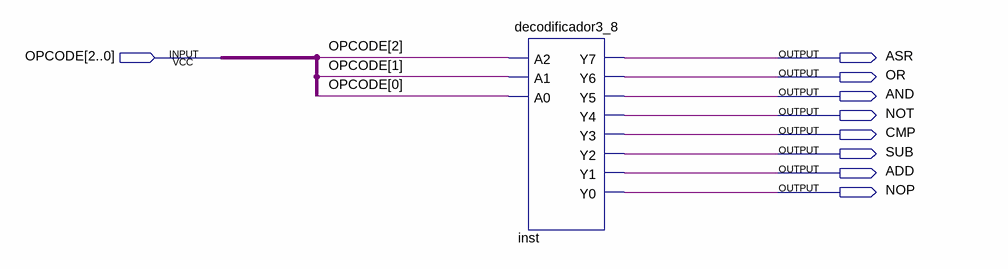
[diagram p0: schematic sheet]
// Quartus schematic inst_decoder.bdf as structural Verilog: 1 symbols, 9 pins
module inst_decoder (
  input  [2:0] OPCODE,
  output ASR,
  output OR,
  output AND,
  output NOT,
  output CMP,
  output SUB,
  output ADD,
  output NOP
);

  decodificador3_8 inst (
    .A2(OPCODE[2]), .A1(OPCODE[1]), .A0(OPCODE[0]), .Y7(ASR), .Y6(OR), .Y5(AND), .Y4(NOT), .Y3(CMP),
    .Y2(SUB), .Y1(ADD), .Y0(NOP));
endmodule
